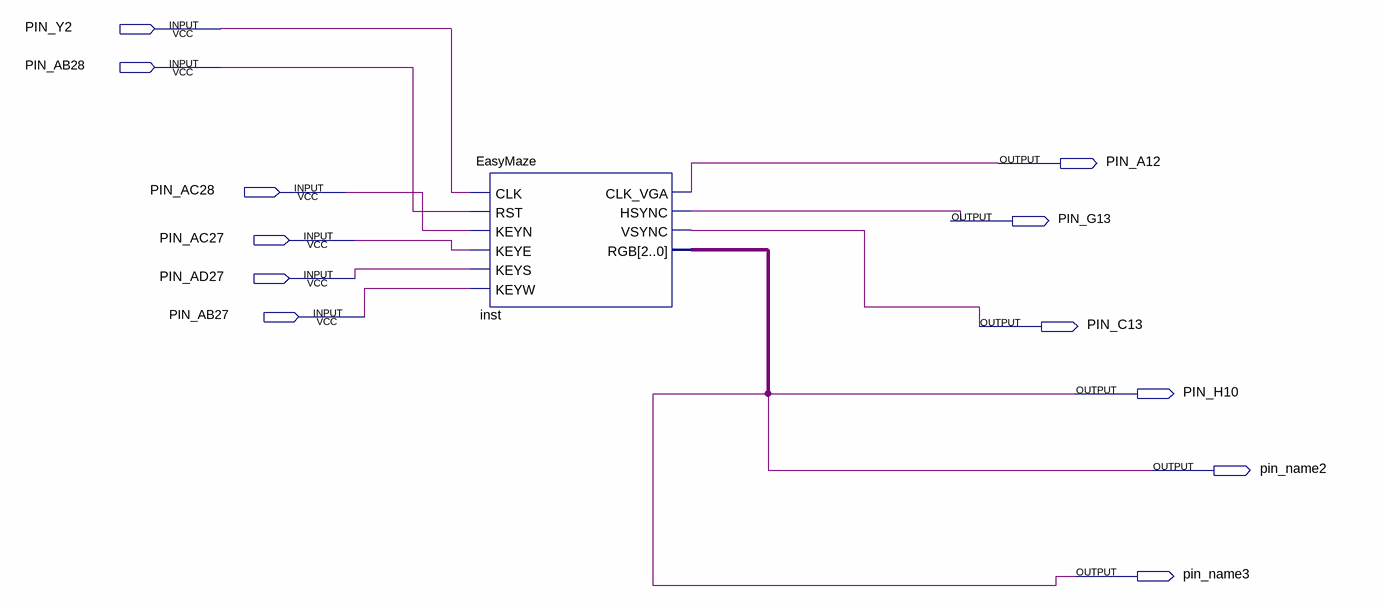
[diagram p0: schematic sheet]
// Quartus schematic EasyMaze.bdf as structural Verilog: 1 symbols, 12 pins
module EasyMaze (
  input  PIN_Y2,
  input  PIN_AB28,
  input  PIN_AC28,
  input  PIN_AC27,
  input  PIN_AD27,
  input  PIN_AB27,
  output PIN_A12,
  output PIN_G13,
  output PIN_C13,
  output PIN_H10,
  output pin_name2,
  output pin_name3
);

  wire inst_hsync;
  wire [2:0] inst_rgb;

  EasyMaze inst (
    .CLK(PIN_Y2), .RST(PIN_AB28), .KEYN(PIN_AC28), .KEYE(PIN_AC27), .KEYS(PIN_AD27), .KEYW(PIN_AB27),
    .CLK_VGA(PIN_A12), .HSYNC(inst_hsync), .VSYNC(PIN_C13), .RGB(inst_rgb));
endmodule
